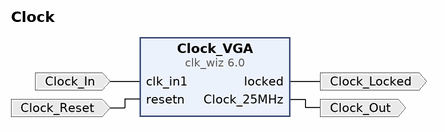
[diagram p0: block diagram of the top level]
# Vivado block design Clock, xc7z010clg400-1, Vivado 2019.2
create_bd_design Clock

create_bd_port -dir I -type clk Clock_In
set_property -dict {CONFIG.CLK_DOMAIN Clock_Clock_In CONFIG.FREQ_HZ 125000000} [get_bd_ports Clock_In]
create_bd_port -dir O Clock_Locked
create_bd_port -dir O -type clk Clock_Out
create_bd_port -dir I -type rst Clock_Reset

create_bd_cell -type ip -vlnv xilinx.com:ip:clk_wiz:6.0 Clock_VGA
set_property -dict [list \
  CONFIG.CLKIN1_JITTER_PS 80.0 \
  CONFIG.CLKOUT1_JITTER 281.423 \
  CONFIG.CLKOUT1_PHASE_ERROR 365.405 \
  CONFIG.CLKOUT1_REQUESTED_OUT_FREQ 25.174 \
  CONFIG.CLK_OUT1_PORT Clock_25MHz \
  CONFIG.MMCM_CLKFBOUT_MULT_F 61.500 \
  CONFIG.MMCM_CLKIN1_PERIOD 8.000 \
  CONFIG.MMCM_CLKOUT0_DIVIDE_F 43.625 \
  CONFIG.MMCM_DIVCLK_DIVIDE 7 \
  CONFIG.PRIM_IN_FREQ 125 \
  CONFIG.RESET_PORT resetn \
  CONFIG.RESET_TYPE ACTIVE_LOW \
] [get_bd_cells Clock_VGA]

# ---- connections ----

connect_bd_net [get_bd_ports Clock_In] [get_bd_pins Clock_VGA/clk_in1]
connect_bd_net [get_bd_pins Clock_VGA/locked] [get_bd_ports Clock_Locked]
connect_bd_net [get_bd_pins Clock_VGA/Clock_25MHz] [get_bd_ports Clock_Out]
connect_bd_net [get_bd_ports Clock_Reset] [get_bd_pins Clock_VGA/resetn]

validate_bd_design
save_bd_design
